# Altium schematic sheet WIRELESS.SchDoc
size A4
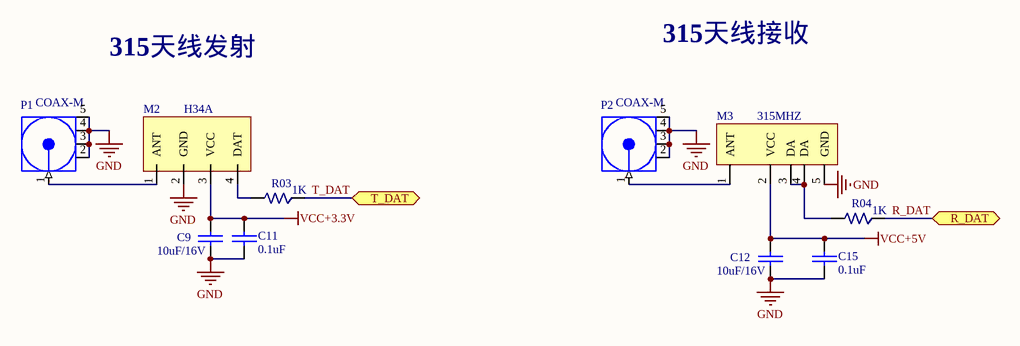
[diagram p0: WIRELESS.SchDoc]

## Parts
C9  10uF/16V  [0805]
C11  0.1uF  [0603]
C12  10uF/16V  [0805]
C15  0.1uF  [0603]
M2  H34A  [H34A]
M3  315MHZ  [315MHZ]
P1  COAX-M  [ST-TH1]
P2  COAX-M  [ST-TH1]
R03  1K  [0603]
R04  1K  [0603]

## Ports
R_DAT, T_DAT

## Nets
GND: C9.1 C11.2 C12.2 C15.2 M2.2(GND) M3.5(GND) P1.2(GND) P1.3(GND) P1.4(GND) P1.5(GND) P2.2(GND) P2.3(GND) P2.4(GND) P2.5(GND)
VCC+3.3V: C9.2 C11.1 M2.3(VCC)
VCC+5V: C12.1 C15.1 M3.2(VCC)
R_DAT: R04.1 ; port R_DAT
T_DAT: R03.1 ; port T_DAT
NetM2_1: M2.1(ANT) P1.1(Signal)
NetM2_4: M2.4(DAT) R03.2
NetM3_1: M3.1(ANT) P2.1(Signal)
NetM3_3: M3.3(DA) M3.4(DA) R04.2

## Notes on the sheet
- 315天线发射
- 315天线接收

## Library data of the parts
C9 C11 C12 C15 = CAP
P1 P2 = COAX-M: SMA-J-P-H-ST-TH1; PackageDocument: Rev. A, 16-Jun-1997; PCB_Layout: Complies with manufacturer's recommendation.; DrillSize: Corresponds to nominal value.; Published: 15-Jul-2004; LatestRevisionDate: 15-Jul-2004; LatestRevisionNote: Component Replaced.; DatasheetDocument: 30-May-2003; PackageReference: 908-21103; Publisher: Altium Limited; ComponentLink1Description: Manufacturer Link; ComponentLink1URL: http://www.amphenolrf.com/
R03 R04 = RES-1%: 高精度电阻